# Altium schematic sheet sht21_board.SchDoc
size 119 x 54 mm
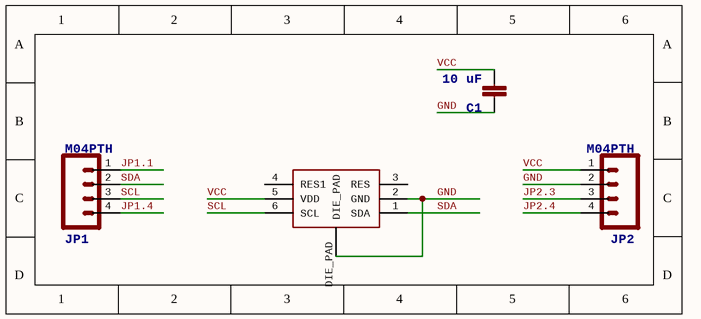
[diagram p0: sht21_board.SchDoc]

## Parts
C1  10 uF  [0805]
JP1  M04PTH  [1X04]
JP2  M04PTH  [1X04]
U$1  SHT21  [SHT21_PADS]  (value not drawn)

## Nets
GND: C1.1 JP2.2 U$1.2(GND) U$1.DIE_PAD
JP1.1: JP1.1
JP1.4: JP1.4
JP2.3: JP2.3
JP2.4: JP2.4
SCL: JP1.3 U$1.6(SCL)
SDA: JP1.2 U$1.1(SDA)
VCC: C1.2 JP2.1 U$1.5(VDD)

Not connected (* = marked no-connect by the designer): U$1 3(RES) 4(RES1)

## Library data of the parts
C1 = CAP0805: <b>Capacitor</b> / Standard 0603 ceramic capacitor, and 0.1" leaded capacitor.
JP1 JP2 = M04PTH: <b>Header 4</b> / Standard 4-pin 0.1" header. Use with straight break away headers (SKU : PRT-00116), right angle break away headers (PRT-00553), swiss pins (PRT-00743), machine pins (PRT-00117), and female headers (PRT-00115). Molex polarized connector foot print use with SKU : PRT-08231 with associated crimp pins and housings. 1MM SMD Version SKU: PRT-10208